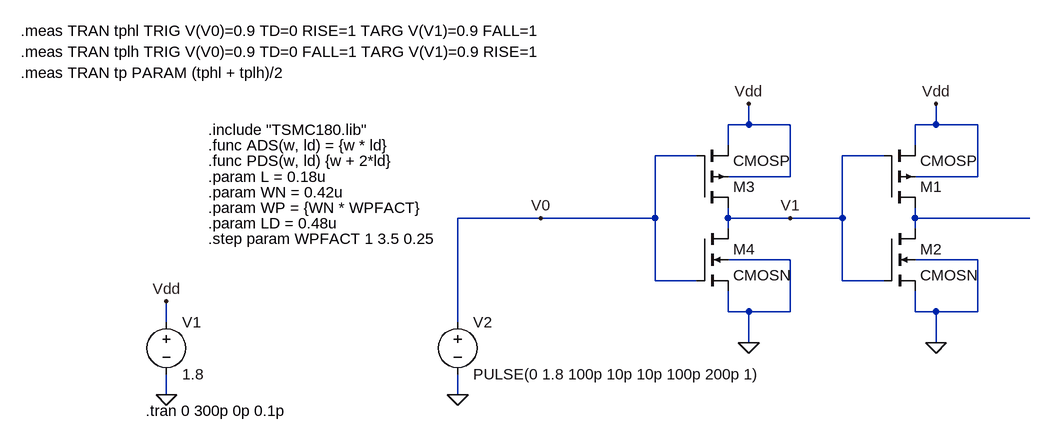
[diagram p0: schematic wpfact.asc]
wpfact.asc, the LTspice schematic file:
Version 4
SHEET 1 1392 680
WIRE 768 80 768 48
WIRE 768 80 736 80
WIRE 832 80 768 80
WIRE 1056 80 1056 48
WIRE 1056 80 1024 80
WIRE 1120 80 1056 80
WIRE 736 112 736 80
WIRE 1024 112 1024 80
WIRE 688 128 624 128
WIRE 976 128 912 128
WIRE 832 160 832 80
WIRE 832 160 736 160
WIRE 1120 160 1120 80
WIRE 1120 160 1024 160
WIRE 448 224 320 224
WIRE 624 224 624 128
WIRE 624 224 448 224
WIRE 736 224 736 208
WIRE 832 224 736 224
WIRE 912 224 912 128
WIRE 912 224 832 224
WIRE 1024 224 1024 208
WIRE 1200 224 1024 224
WIRE 736 240 736 224
WIRE 1024 240 1024 224
WIRE 832 288 736 288
WIRE 1120 288 1024 288
WIRE 624 320 624 224
WIRE 688 320 624 320
WIRE 912 320 912 224
WIRE 976 320 912 320
WIRE 736 368 736 336
WIRE 768 368 736 368
WIRE 832 368 832 288
WIRE 832 368 768 368
WIRE 1024 368 1024 336
WIRE 1056 368 1024 368
WIRE 1120 368 1120 288
WIRE 1120 368 1056 368
WIRE -128 384 -128 352
WIRE 320 384 320 224
WIRE 768 416 768 368
WIRE 1056 416 1056 368
WIRE -128 496 -128 464
WIRE 320 496 320 464
FLAG 768 416 0
FLAG -128 496 0
FLAG -128 352 Vdd
FLAG 768 48 Vdd
FLAG 320 496 0
FLAG 448 224 V0
FLAG 1056 416 0
FLAG 1056 48 Vdd
FLAG 832 224 V1
SYMBOL pmos4 688 208 M180
SYMATTR InstName M3
SYMATTR Value CMOSP
SYMATTR Value2 l={L} w={WP} ad={ADS(WP, LD)} as={ADS(WP, LD)} pd={PDS(WP, LD)} ps={PDS(WP, LD)}
SYMBOL nmos4 688 240 R0
SYMATTR InstName M4
SYMATTR Value CMOSN
SYMATTR Value2 l={L} w={WN} ad={ADS(WN, LD)} as={ADS(WN, LD)} pd={PDS(WN, LD)} ps={PDS(WN, LD)}
SYMBOL voltage -128 368 R0
WINDOW 123 0 0 Left 0
WINDOW 39 0 0 Left 0
SYMATTR InstName V1
SYMATTR Value 1.8
SYMBOL voltage 320 368 R0
WINDOW 123 0 0 Left 0
WINDOW 39 0 0 Left 0
SYMATTR InstName V2
SYMATTR Value PULSE(0 1.8 100p 10p 10p 100p 200p 1)
SYMBOL pmos4 976 208 M180
SYMATTR InstName M1
SYMATTR Value CMOSP
SYMATTR Value2 l={L} w={WP} ad={ADS(WP, LD)} as={ADS(WP, LD)} pd={PDS(WP, LD)} ps={PDS(WP, LD)}
SYMBOL nmos4 976 240 R0
SYMATTR InstName M2
SYMATTR Value CMOSN
SYMATTR Value2 l={L} w={WN} ad={ADS(WN, LD)} as={ADS(WN, LD)} pd={PDS(WN, LD)} ps={PDS(WN, LD)}
TEXT -64 88 Left 2 !.include "TSMC180.lib"
TEXT -64 112 Left 2 !.func ADS(w, ld) = {w * ld}
TEXT -64 136 Left 2 !.func PDS(w, ld) {w + 2*ld}
TEXT -64 208 Left 2 !.param WP = {WN * WPFACT}
TEXT -64 160 Left 2 !.param L = 0.18u
TEXT -64 232 Left 2 !.param LD = 0.48u
TEXT -64 184 Left 2 !.param WN = 0.42u
TEXT -160 520 Left 2 !.tran 0 300p 0p 0.1p
TEXT -64 256 Left 2 !.step param WPFACT 1 3.5 0.25
TEXT -352 -64 Left 2 !.meas TRAN tphl TRIG V(V0)=0.9 TD=0 RISE=1 TARG V(V1)=0.9 FALL=1
TEXT -352 -32 Left 2 !.meas TRAN tplh TRIG V(V0)=0.9 TD=0 FALL=1 TARG V(V1)=0.9 RISE=1
TEXT -352 0 Left 2 !.meas TRAN tp PARAM (tphl + tplh)/2

The netlist it stands for:
* wpfact.asc
M3 V1 V0 Vdd Vdd CMOSP l={L} w={WP} ad={ADS(WP, LD)} as={ADS(WP, LD)} pd={PDS(WP, LD)} ps={PDS(WP, LD)}
M4 V1 V0 0 0 CMOSN l={L} w={WN} ad={ADS(WN, LD)} as={ADS(WN, LD)} pd={PDS(WN, LD)} ps={PDS(WN, LD)}
V1 Vdd 0 1.8
V2 V0 0 PULSE(0 1.8 100p 10p 10p 100p 200p 1)
M1 N001 V1 Vdd Vdd CMOSP l={L} w={WP} ad={ADS(WP, LD)} as={ADS(WP, LD)} pd={PDS(WP, LD)} ps={PDS(WP, LD)}
M2 N001 V1 0 0 CMOSN l={L} w={WN} ad={ADS(WN, LD)} as={ADS(WN, LD)} pd={PDS(WN, LD)} ps={PDS(WN, LD)}
.model NMOS NMOS
.model PMOS PMOS
.lib standard.mos
.include "TSMC180.lib"
.func ADS(w, ld) = {w * ld}
.func PDS(w, ld) {w + 2*ld}
.param WP = {WN * WPFACT}
.param L = 0.18u
.param LD = 0.48u
.param WN = 0.42u
.tran 0 300p 0p 0.1p
.step param WPFACT 1 3.5 0.25
.meas TRAN tphl TRIG V(V0)=0.9 TD=0 RISE=1 TARG V(V1)=0.9 FALL=1
.meas TRAN tplh TRIG V(V0)=0.9 TD=0 FALL=1 TARG V(V1)=0.9 RISE=1
.meas TRAN tp PARAM (tphl + tplh)/2
.backanno
.end